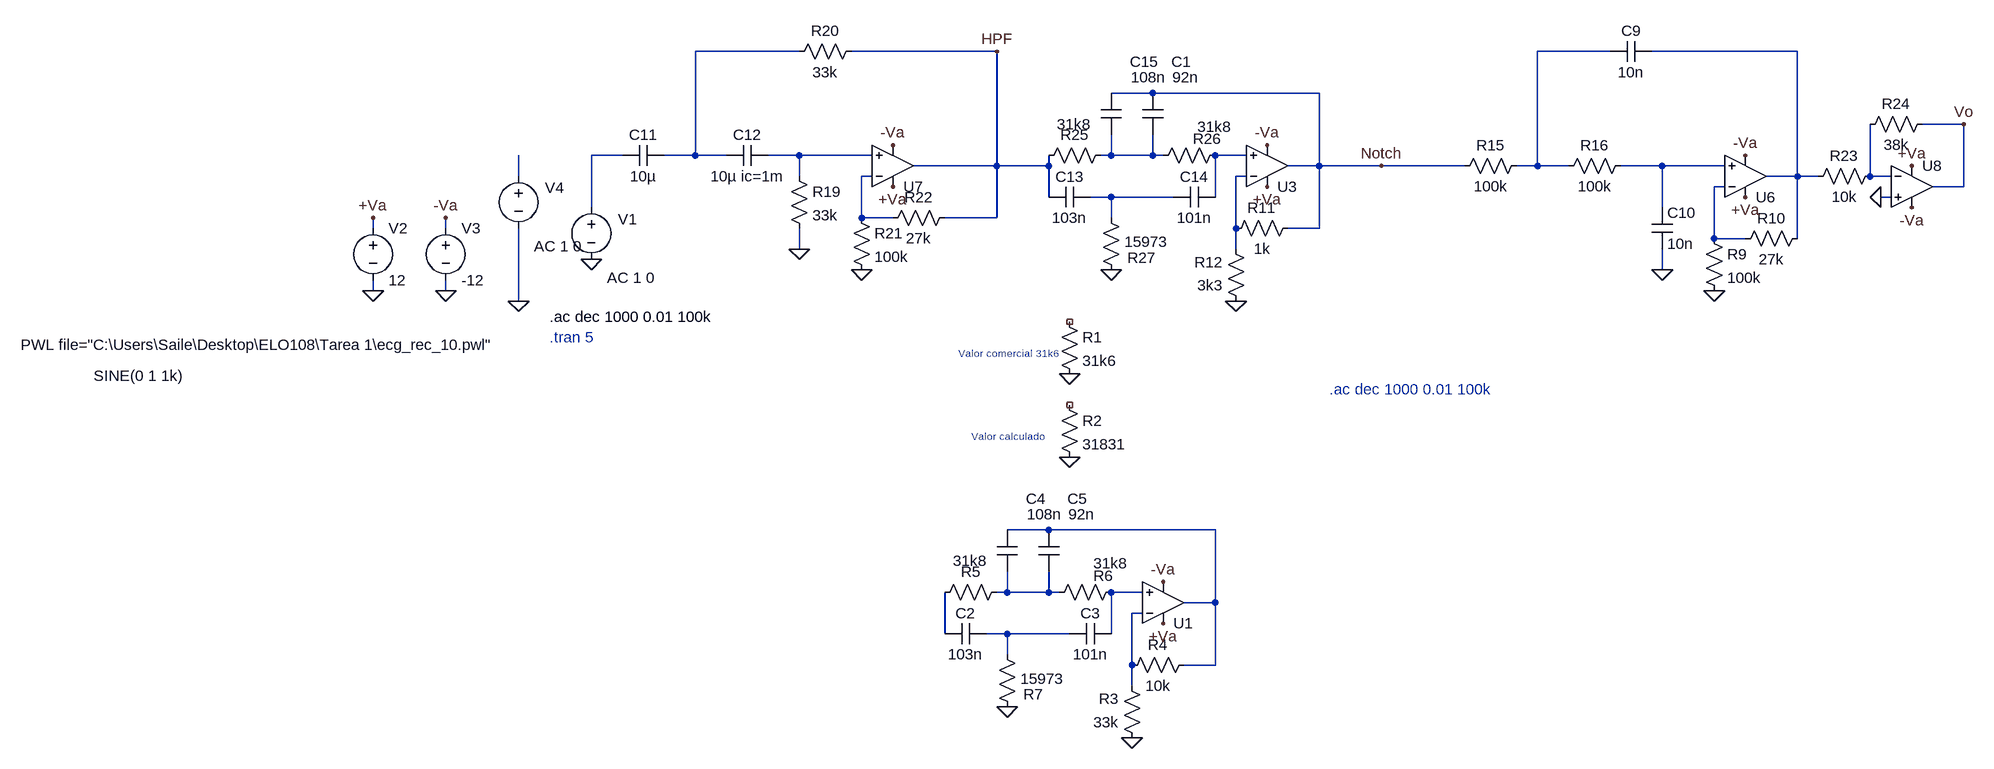
[diagram p0: schematic HPF_NotchTwinT_LPF_Bessel.asc]
HPF_NotchTwinT_LPF_Bessel.asc, the LTspice schematic file:
Version 4.1
SHEET 1 1876 2836
WIRE -32 -160 -192 -160
WIRE 272 -160 48 -160
WIRE 1216 -160 1104 -160
WIRE 1504 -160 1280 -160
WIRE 512 -96 448 -96
WIRE 768 -96 512 -96
WIRE 1760 -48 1696 -48
WIRE -304 0 -352 0
WIRE -192 0 -192 -160
WIRE -192 0 -240 0
WIRE -144 0 -192 0
WIRE -32 0 -80 0
WIRE 80 0 -32 0
WIRE 448 0 448 -32
WIRE 448 0 432 0
WIRE 512 0 512 -32
WIRE 512 0 448 0
WIRE 528 0 512 0
WIRE 656 0 608 0
WIRE 272 16 272 -160
WIRE 272 16 144 16
WIRE 352 16 352 0
WIRE 352 16 272 16
WIRE 768 16 768 -96
WIRE 768 16 720 16
WIRE 864 16 768 16
WIRE 992 16 864 16
WIRE 1104 16 1104 -160
WIRE 1104 16 1072 16
WIRE 1152 16 1104 16
WIRE 1296 16 1232 16
WIRE 1392 16 1296 16
WIRE -464 32 -464 0
WIRE -32 32 -32 0
WIRE 80 32 64 32
WIRE 656 32 640 32
WIRE 1504 32 1504 -160
WIRE 1504 32 1456 32
WIRE 1536 32 1504 32
WIRE 1616 32 1616 -48
WIRE 1648 32 1616 32
WIRE 1392 48 1376 48
WIRE 1760 48 1760 -48
WIRE 1760 48 1712 48
WIRE 352 64 352 16
WIRE 448 64 416 64
WIRE 544 64 448 64
WIRE 608 64 608 0
WIRE 1648 64 1632 64
WIRE -352 80 -352 0
WIRE 1296 80 1296 16
WIRE 64 96 64 32
WIRE 112 96 64 96
WIRE 272 96 272 16
WIRE 272 96 192 96
WIRE 448 96 448 64
WIRE -688 112 -688 96
WIRE -576 112 -576 96
WIRE 640 112 640 32
WIRE 768 112 768 16
WIRE 768 112 720 112
WIRE 1376 128 1376 48
WIRE 1424 128 1376 128
WIRE 1504 128 1504 32
WIRE -32 144 -32 112
WIRE 640 144 640 112
WIRE 1296 176 1296 144
WIRE -688 208 -688 192
WIRE -576 208 -576 192
WIRE -464 224 -464 112
WIRE 352 576 288 576
WIRE 608 576 352 576
WIRE 288 672 288 640
WIRE 288 672 272 672
WIRE 352 672 352 640
WIRE 352 672 288 672
WIRE 368 672 352 672
WIRE 496 672 448 672
WIRE 608 688 608 576
WIRE 608 688 560 688
WIRE 496 704 480 704
WIRE 192 736 192 672
WIRE 288 736 256 736
WIRE 384 736 288 736
WIRE 448 736 448 672
WIRE 288 768 288 736
WIRE 480 784 480 704
WIRE 608 784 608 688
WIRE 608 784 560 784
WIRE 480 816 480 784
FLAG -688 96 +Va
FLAG -688 208 0
FLAG -576 96 -Va
FLAG -576 208 0
FLAG 640 224 0
FLAG 1424 64 +Va
FLAG 1424 0 -Va
FLAG 1296 176 0
FLAG -464 224 0
FLAG 688 -16 -Va
FLAG 688 48 +Va
FLAG -32 144 0
FLAG 1760 -48 Vo
FLAG 112 48 +Va
FLAG 112 -16 -Va
FLAG 864 16 Notch
FLAG 272 -160 HPF
FLAG 64 176 0
FLAG 1632 64 0
FLAG 1680 80 -Va
FLAG 1680 16 +Va
FLAG 448 176 0
FLAG 1376 208 0
FLAG 384 336 0
FLAG 384 464 0
FLAG -352 160 0
FLAG 480 896 0
FLAG 528 656 -Va
FLAG 528 720 +Va
FLAG 288 848 0
SYMBOL voltage -688 96 R0
WINDOW 123 0 0 Left 2
WINDOW 39 0 0 Left 2
SYMATTR InstName V2
SYMATTR Value 12
SYMBOL voltage -576 96 R0
WINDOW 123 24 146 Left 2
WINDOW 39 24 125 Left 2
SYMATTR InstName V3
SYMATTR Value -12
SYMBOL OpAmps\\UniversalOpAmp2 688 16 M180
SYMATTR InstName U3
SYMBOL res 656 240 R180
WINDOW 0 36 76 Left 2
WINDOW 3 36 40 Left 2
SYMATTR InstName R12
SYMATTR Value 3k3
SYMBOL res 1088 0 R90
WINDOW 0 0 56 VBottom 2
WINDOW 3 32 56 VTop 2
SYMATTR InstName R15
SYMATTR Value 100k
SYMBOL res 1248 0 R90
WINDOW 0 0 56 VBottom 2
WINDOW 3 32 56 VTop 2
SYMATTR InstName R16
SYMATTR Value 100k
SYMBOL cap 1280 -176 R90
WINDOW 0 0 32 VBottom 2
WINDOW 3 32 32 VTop 2
SYMATTR InstName C9
SYMATTR Value 10n
SYMBOL cap 1280 80 R0
SYMATTR InstName C10
SYMATTR Value 10n
SYMBOL voltage -464 16 R0
WINDOW 0 41 34 Left 2
WINDOW 123 24 124 Left 2
WINDOW 39 0 0 Left 0
WINDOW 3 -766 275 Left 2
SYMATTR InstName V4
SYMATTR Value2 AC 1 0
SYMATTR Value PWL file="C:\Users\Saile\Desktop\ELO108\Tarea 1\ecg_rec_10.pwl"
SYMBOL OpAmps\\UniversalOpAmp2 1424 32 M180
SYMATTR InstName U6
SYMBOL res 736 96 R90
WINDOW 0 0 56 VBottom 2
WINDOW 3 32 56 VTop 2
SYMATTR InstName R11
SYMATTR Value 1k
SYMBOL cap -240 -16 R90
WINDOW 0 0 32 VBottom 2
WINDOW 3 32 32 VTop 2
SYMATTR InstName C11
SYMATTR Value 10µ
SYMBOL cap -80 -16 R90
WINDOW 0 0 32 VBottom 2
WINDOW 3 32 32 VTop 2
SYMATTR InstName C12
SYMATTR Value 10µ ic=1m
SYMBOL res -48 16 R0
SYMATTR InstName R19
SYMATTR Value 33k
SYMBOL res 64 -176 R90
WINDOW 0 0 56 VBottom 2
WINDOW 3 32 56 VTop 2
SYMATTR InstName R20
SYMATTR Value 33k
SYMBOL OpAmps\\UniversalOpAmp2 112 16 M180
SYMATTR InstName U7
SYMBOL res 48 80 R0
SYMATTR InstName R21
SYMATTR Value 100k
SYMBOL res 208 80 R90
WINDOW 0 0 56 VBottom 2
WINDOW 3 32 56 VTop 2
SYMATTR InstName R22
SYMATTR Value 27k
SYMBOL OpAmps\\UniversalOpAmp2 1680 48 R0
SYMATTR InstName U8
SYMBOL res 1632 16 R90
WINDOW 0 0 56 VBottom 2
WINDOW 3 32 56 VTop 2
SYMATTR InstName R23
SYMATTR Value 10k
SYMBOL res 1712 -64 R90
WINDOW 0 0 56 VBottom 2
WINDOW 3 32 56 VTop 2
SYMATTR InstName R24
SYMATTR Value 38k
SYMBOL res 448 -16 R90
WINDOW 0 0 56 VBottom 2
WINDOW 3 -48 57 VTop 2
SYMATTR InstName R25
SYMATTR Value 31k8
SYMBOL res 624 -16 R90
WINDOW 0 6 28 VBottom 2
WINDOW 3 -44 17 VTop 2
SYMATTR InstName R26
SYMATTR Value 31k8
SYMBOL cap 416 48 R90
WINDOW 0 0 32 VBottom 2
WINDOW 3 32 32 VTop 2
SYMATTR InstName C13
SYMATTR Value 103n
SYMBOL cap 608 48 R90
WINDOW 0 0 32 VBottom 2
WINDOW 3 32 32 VTop 2
SYMATTR InstName C14
SYMATTR Value 101n
SYMBOL cap 432 -96 R0
WINDOW 3 46 -24 Left 2
WINDOW 0 45 -48 Left 2
SYMATTR Value 108n
SYMATTR InstName C15
SYMBOL res 432 80 R0
WINDOW 0 41 77 Left 2
WINDOW 3 36 53 Left 2
SYMATTR InstName R27
SYMATTR Value 15973
SYMBOL res 1360 112 R0
SYMATTR InstName R9
SYMATTR Value 100k
SYMBOL res 1520 112 R90
WINDOW 0 0 56 VBottom 2
WINDOW 3 32 56 VTop 2
SYMATTR InstName R10
SYMATTR Value 27k
SYMBOL res 368 240 R0
SYMATTR InstName R1
SYMATTR Value 31k6
SYMBOL res 368 368 R0
SYMATTR InstName R2
SYMATTR Value 31831
SYMBOL cap 496 -96 R0
WINDOW 3 46 -24 Left 2
WINDOW 0 45 -48 Left 2
SYMATTR Value 92n
SYMATTR InstName C1
SYMBOL voltage -352 64 R0
WINDOW 0 41 34 Left 2
WINDOW 123 24 124 Left 2
WINDOW 39 0 0 Left 0
WINDOW 3 -766 275 Left 2
SYMATTR InstName V1
SYMATTR Value2 AC 1 0
SYMATTR Value SINE(0 1 1k)
SYMBOL OpAmps\\UniversalOpAmp2 528 688 M180
SYMATTR InstName U1
SYMBOL res 496 912 R180
WINDOW 0 36 76 Left 2
WINDOW 3 36 40 Left 2
SYMATTR InstName R3
SYMATTR Value 33k
SYMBOL res 576 768 R90
WINDOW 0 0 56 VBottom 2
WINDOW 3 32 56 VTop 2
SYMATTR InstName R4
SYMATTR Value 10k
SYMBOL res 288 656 R90
WINDOW 0 0 56 VBottom 2
WINDOW 3 -48 57 VTop 2
SYMATTR InstName R5
SYMATTR Value 31k8
SYMBOL res 464 656 R90
WINDOW 0 6 28 VBottom 2
WINDOW 3 -44 17 VTop 2
SYMATTR InstName R6
SYMATTR Value 31k8
SYMBOL cap 256 720 R90
WINDOW 0 0 32 VBottom 2
WINDOW 3 32 32 VTop 2
SYMATTR InstName C2
SYMATTR Value 103n
SYMBOL cap 448 720 R90
WINDOW 0 0 32 VBottom 2
WINDOW 3 32 32 VTop 2
SYMATTR InstName C3
SYMATTR Value 101n
SYMBOL cap 272 576 R0
WINDOW 3 46 -24 Left 2
WINDOW 0 45 -48 Left 2
SYMATTR Value 108n
SYMATTR InstName C4
SYMBOL res 272 752 R0
WINDOW 0 41 77 Left 2
WINDOW 3 36 53 Left 2
SYMATTR InstName R7
SYMATTR Value 15973
SYMBOL cap 336 576 R0
WINDOW 3 46 -24 Left 2
WINDOW 0 45 -48 Left 2
SYMATTR Value 92n
SYMATTR InstName C5
TEXT -416 248 Left 2 !.ac dec 1000 0.01 100k
TEXT -416 280 Left 2 ;.tran 5
TEXT 784 360 Left 2 ;.ac dec 1000 0.01 100k
TEXT 288 304 Center 1 ;Valor comercial 31k6
TEXT 288 432 Center 1 ;Valor calculado

The netlist it stands for:
* HPF_NotchTwinT_LPF_Bessel.asc
V2 +Va 0 12
V3 -Va 0 -12
X§U3 N007 N011 +Va -Va Notch level2 Avol=1Meg GBW=10Meg Slew=10Meg Ilimit=25m Rail=0 Vos=0 En=0 Enk=0 In=0 Ink=0 Rin=500Meg  ; pins In+ In- V+ V- OUT
R12 0 N011 3k3
R15 N002 Notch 100k
R16 N008 N002 100k
C9 N003 N002 10n
C10 N008 0 10n
V4 N009 0 PWL file="C:\Users\Saile\Desktop\ELO108\Tarea 1\ecg_rec_10.pwl" AC 1 0
X§U6 N008 N013 +Va -Va N003 level2 Avol=1Meg GBW=10Meg Slew=10Meg Ilimit=25m Rail=0 Vos=0 En=0 Enk=0 In=0 Ink=0 Rin=500Meg  ; pins In+ In- V+ V- OUT
R11 Notch N011 1k
C11 N001 N004 10µ
C12 N005 N001 10µ ic=1m
R19 N005 0 33k
R20 HPF N001 33k
X§U7 N005 N010 +Va -Va HPF level2 Avol=1Meg GBW=10Meg Slew=10Meg Ilimit=25m Rail=0 Vos=0 En=0 Enk=0 In=0 Ink=0 Rin=500Meg  ; pins In+ In- V+ V- OUT
R21 N010 0 100k
R22 HPF N010 27k
X§U8 0 N012 +Va -Va Vo level2 Avol=1Meg GBW=10Meg Slew=10Meg Ilimit=25m Rail=0 Vos=0 En=0 Enk=0 In=0 Ink=0 Rin=500Meg  ; pins In+ In- V+ V- OUT
R23 N012 N003 10k
R24 Vo N012 38k
R25 N006 HPF 31k8
R26 N007 N006 31k8
C13 N014 HPF 103n
C14 N007 N014 101n
C15 Notch N006 108n
R27 N014 0 15973
R9 N013 0 100k
R10 N003 N013 27k
R1 NC_01 0 31k6
R2 NC_02 0 31831
C1 Notch N006 92n
V1 N004 0 SINE(0 1 1k) AC 1 0
X§U1 N017 N018 +Va -Va N015 level2 Avol=1Meg GBW=10Meg Slew=10Meg Ilimit=25m Rail=0 Vos=0 En=0 Enk=0 In=0 Ink=0 Rin=500Meg  ; pins In+ In- V+ V- OUT
R3 0 N018 33k
R4 N015 N018 10k
R5 N016 N019 31k8
R6 N017 N016 31k8
C2 N020 N019 103n
C3 N017 N020 101n
C4 N015 N016 108n
R7 N020 0 15973
C5 N015 N016 92n
.ac dec 1000 0.01 100k
* .tran 5
* .ac dec 1000 0.01 100k
* Valor comercial 31k6
* Valor calculado
.lib UniversalOpAmp2.lib
.backanno
.end